# Altium schematic sheet PG01_Power_Supply.SchDoc
size A4
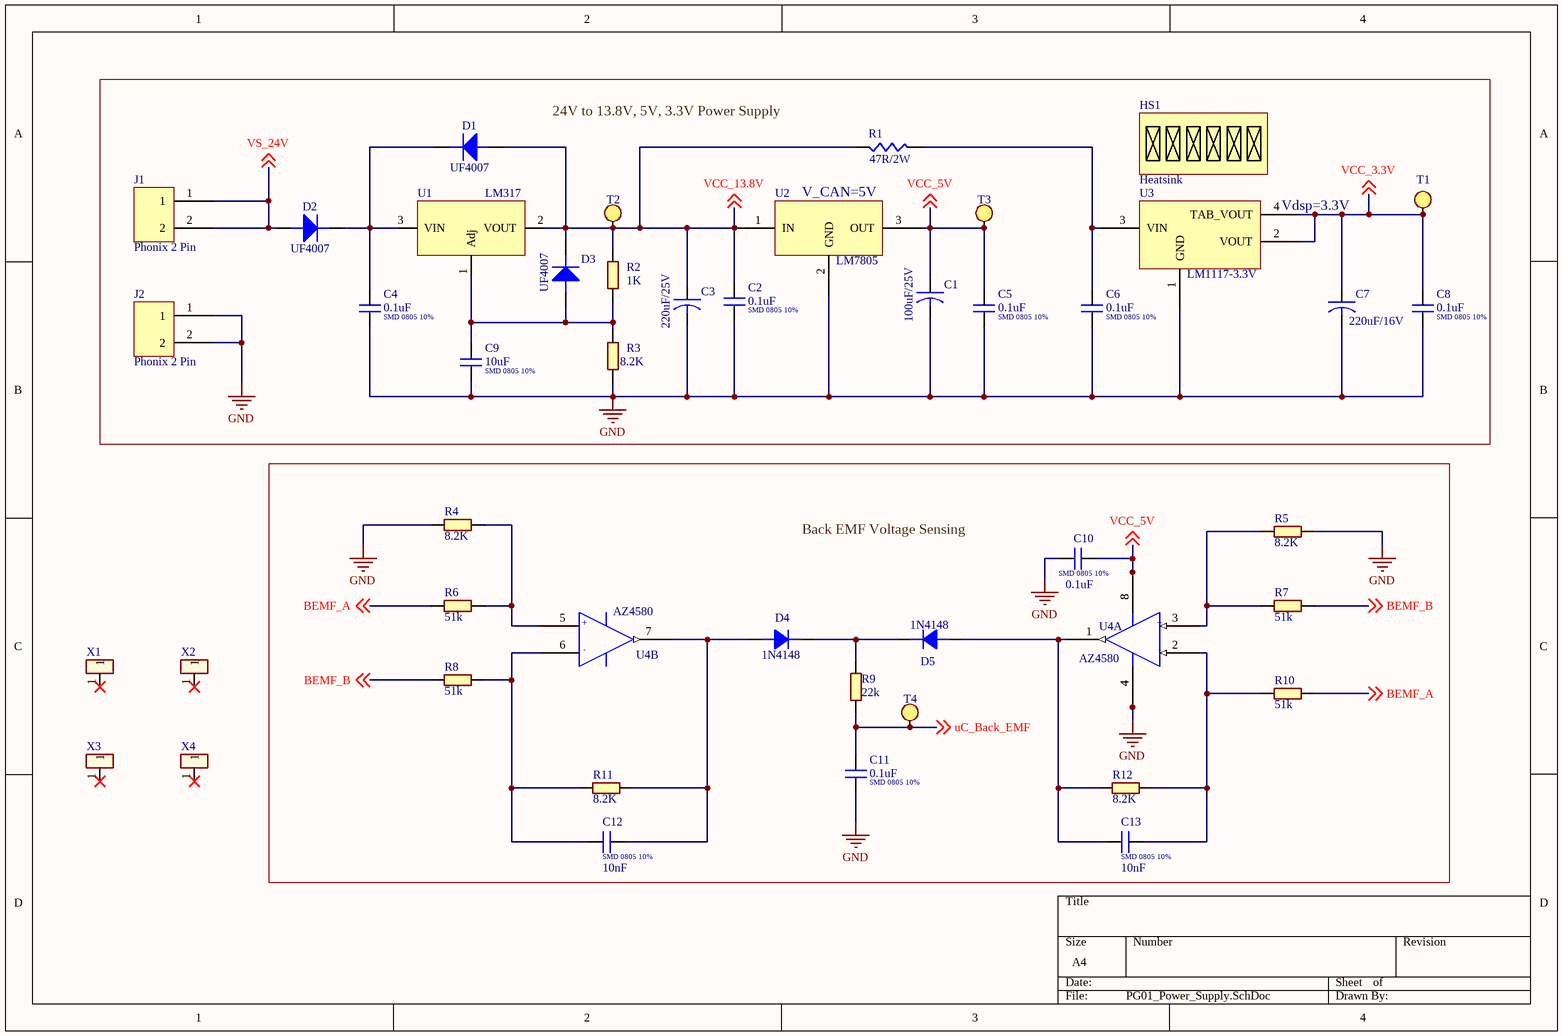
[diagram p0: PG01_Power_Supply.SchDoc]

## Parts
C1  value 100uF/25V  [CAP 5MM]  (hidden comment: Electrolyte Cap)
C2  SMD 0805 10%  value 0.1uF  [SMD0805]
C3  value 220uF/25V  [CAP_8mm]  (hidden comment: Electrolyte Cap)
C4  SMD 0805 10%  value 0.1uF  [SMD0805]
C5  SMD 0805 10%  value 0.1uF  [SMD0805]
C6  SMD 0805 10%  value 0.1uF  [SMD0805]
C7  value 220uF/16V  [CAP_8mm]  (hidden comment: Electrolyte Cap)
C8  SMD 0805 10%  value 0.1uF  [SMD0805]
C9  SMD 0805 10%  value 10uF  [SMD0805]
C10  SMD 0805 10%  value 0.1uF  [SMD0805]
C11  SMD 0805 10%  value 0.1uF  [SMD0805]
C12  SMD 0805 10%  value 10nF  [SMD0805]
C13  SMD 0805 10%  value 10nF  [SMD0805]
D1  value UF4007  [DO-214(SMA)]  (hidden comment: Diode SMA)
D2  value UF4007  [DO-214(SMA)]  (hidden comment: Diode SMA)
D3  value UF4007  [DO-214(SMA)]  (hidden comment: Diode SMA)
D4  1N4148  [SOD-80]
D5  1N4148  [SOD-80]
HS1  Heatsink  [Heatsink_25mm]
J1  Phonix 2 Pin  [PHONIX2]
J2  Phonix 2 Pin  [PHONIX2]
R1  value 47R/2W  [Axial_2W_Vert]  (hidden comment: Series Resistor)
R2  value 1K  [SMD1206]  (hidden comment: SMD 1206 1%)
R3  value 8.2K  [SMD1206]  (hidden comment: SMD 1206 1%)
R4  value 8.2K  [SMD1206]  (hidden comment: SMD 1206 1%)
R5  value 8.2K  [SMD1206]  (hidden comment: SMD 1206 1%)
R6  value 51k  [SMD1206]  (hidden comment: SMD 1206 1%)
R7  value 51k  [SMD1206]  (hidden comment: SMD 1206 1%)
R8  value 51k  [SMD1206]  (hidden comment: SMD 1206 1%)
R9  value 22k  [SMD1206]  (hidden comment: SMD 1206 1%)
R10  value 51k  [SMD1206]  (hidden comment: SMD 1206 1%)
R11  value 8.2K  [SMD1206]  (hidden comment: SMD 1206 1%)
R12  value 8.2K  [SMD1206]  (hidden comment: SMD 1206 1%)
T1  Through hole TestPoint  [TP]  (value not drawn)
T2  Through hole TestPoint  [TP]  (value not drawn)
T3  Through hole TestPoint  [TP]  (value not drawn)
T4  Through hole TestPoint  [TP]  (value not drawn)
U1  LM317  [TO220_Normal]
U2  LM7805  [TO220_Normal]
U3  value LM1117-3.3V  [SOT-223]  (hidden comment: 3.3V Regulator)
U4  value AZ4580  [SOIC-8]  (hidden comment: LM358)  (parts A,B of 2)
X1  TP  [Screw]  (value not drawn)
X2  TP  [Screw]  (value not drawn)
X3  TP  [Screw]  (value not drawn)
X4  TP  [Screw]  (value not drawn)

## Blocks framed on the sheet
Back EMF Voltage Sensing: C10-C13 D4 D5 R4-R12 T4 U4

## Nets
GND: C1.2 C2.2 C3.2 C4.2 C5.2 C6.2 C7.2 C8.2 C9.2 C10.1 C11.2 J2.1 J2.2 R3.1 R4.2 R5.1 U2.2(GND) U3.1(GND) U4.4(GND)
BEMF_A: R6.2 R10.1 ; off-sheet BEMF_A
BEMF_B: R7.1 R8.2 ; off-sheet BEMF_B
uC_Back_EMF: C11.1 R9.2 T4.1 ; off-sheet uC_Back_EMF
VCC_3.3V: C7.1 C8.1 T1.1 U3.2(VOUT) U3.4(TAB_VOUT) ; off-sheet VCC_3.3V
VCC_5V: C1.1 C5.1 C10.2 T3.1 U2.3(OUT) U4.8(VCC) ; off-sheet VCC_5V
VCC_13.8V: C2.1 C3.1 D1.1 D3.2 R1.1 R2.2 T2.1 U1.2(VOUT) U2.1(IN) ; off-sheet VCC_13.8V
VS_24V: D2.1 J1.1 J1.2 ; off-sheet VS_24V
NetC4_1: C4.1 D1.2 D2.2 U1.3(VIN)
NetC6_1: C6.1 R1.2 U3.3(VIN)
NetC9_1: C9.1 D3.1 R2.1 R3.2 U1.1(Adj)
NetC12_1: C12.1 D4.1(ANODE) R11.1 U4.7(OUT)
NetC12_2: C12.2 R8.1 R11.2 U4.6(-IN)
NetC13_1: C13.1 R10.2 R12.1 U4.2(-IN)
NetC13_2: C13.2 D5.1(ANODE) R12.2 U4.1(OUT)
NetD4_2: D4.2(CATHODE) D5.2(CATHODE) R9.1
NetR4_1: R4.1 R6.1 U4.5(+IN)
NetR5_2: R5.2 R7.2 U4.3(+IN)

Not connected (* = marked no-connect by the designer): X1 1*; X2 1*; X3 1*; X4 1*

## Notes on the sheet
- 24V to 13.8V, 5V, 3.3V Power Supply
- V_CAN=5V
- (near U3) Vdsp=3.3V
- (in symbol LM358, part A) +; -
- (in symbol LM358, part B) +; -

## Library data of the parts
C1 C3 C7 = CAP
C2 C4-C6 C8-C13 = CAP_SMD: Manufacturer: Vishay
D1-D3 = Diode_SMA: Manufacturer: Diodes Corp
D4 D5 = 1N4148: Part No.: SM4007; Manufacturer: Vishay; Source Of Supply: Rajiv Electronics,Pune; Type: Component; Temp. Range: -65 to 150 Deg. Cel.; Tolerance: 10%; Rating: -; Temp. Coeff.: -; Termination: -; Marking: -; Category: Diode
HS1 = HS_15W: Value: Heatsink
J1 J2 = Phonix_2_Pin
R1 = RES_TH: Manufacturer: *
R2-R12 = RES_SMD: Manufacturer: Vishay; Description: SMD1206  1% Resistor
T1-T4 = TestPoint_TH: Value: TP
U3 = LM1117
U4 = LM358: Manufacturer: ST Semiconductor
X1-X4 = TEST POINT_0: Temp. Range: -40 to 85 Deg. Cel.; Tolerance: -; Temp. Coeff.: -; Category: Test Point; Rating: -; Termination: -; Marking: -; Manufacturer: -
U1 = LM317: Value: LM317
U2 = LM7805: Value: LM7805